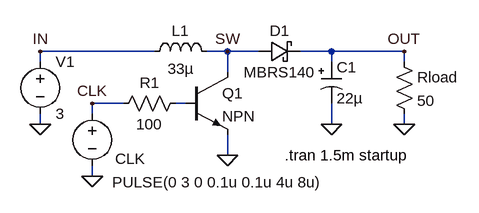
[diagram p0: schematic StepUp.asc]
StepUp.asc, the LTspice schematic file:
Version 4
SHEET 1 2376 1416
WIRE 1552 944 1376 944
WIRE 1664 944 1632 944
WIRE 1712 944 1664 944
WIRE 1824 944 1776 944
WIRE 1936 944 1824 944
WIRE 1376 960 1376 944
WIRE 1824 960 1824 944
WIRE 1936 960 1936 944
WIRE 1664 976 1664 944
WIRE 1504 1024 1456 1024
WIRE 1600 1024 1584 1024
WIRE 1456 1040 1456 1024
WIRE 1376 1056 1376 1040
WIRE 1824 1056 1824 1024
WIRE 1936 1056 1936 1040
WIRE 1664 1104 1664 1072
WIRE 1456 1136 1456 1120
FLAG 1936 944 OUT
FLAG 1824 1056 0
FLAG 1936 1056 0
FLAG 1376 1056 0
FLAG 1664 1104 0
FLAG 1376 944 IN
FLAG 1456 1136 0
FLAG 1456 1024 CLK
FLAG 1664 944 SW
SYMBOL VOLTAGE 1376 944 R0
WINDOW 123 0 0 Left 0
SYMATTR InstName V1
SYMATTR Value 3
SYMATTR SpiceLine Rser=0.1
SYMBOL POLCAP 1808 960 R0
SYMATTR InstName C1
SYMATTR Value 22µ
SYMATTR SpiceLine Rser=0.02
SYMBOL schottky 1712 960 R270
WINDOW 0 32 32 VTop 0
WINDOW 3 0 32 VBottom 0
SYMATTR InstName D1
SYMATTR Value MBRS140
SYMBOL IND 1536 960 R270
WINDOW 0 32 56 VTop 0
WINDOW 3 5 56 VBottom 0
SYMATTR InstName L1
SYMATTR Value 33µ
SYMATTR SpiceLine Rser=0.02 Rpar=5000
SYMBOL res 1920 944 R0
SYMATTR InstName Rload
SYMATTR Value 50
SYMBOL npn 1600 976 R0
SYMATTR InstName Q1
SYMBOL res 1600 1008 R90
WINDOW 0 0 56 VBottom 0
WINDOW 3 32 56 VTop 0
SYMATTR InstName R1
SYMATTR Value 100
SYMBOL voltage 1456 1024 R0
WINDOW 0 35 85 Left 0
WINDOW 3 31 121 Left 0
WINDOW 123 0 0 Left 0
WINDOW 39 0 0 Left 0
SYMATTR InstName CLK
SYMATTR Value PULSE(0 3 0 0.1u 0.1u 4u 8u)
TEXT 1752 1104 Left 0 !.tran 1.5m startup

The netlist it stands for:
* StepUp.asc
V1 IN 0 3 Rser=0.1
C1 OUT 0 22µ Rser=0.02
D1 SW OUT MBRS140
L1 IN SW 33µ Rser=0.02 Rpar=5000
Rload OUT 0 50
Q1 SW N001 0 0 NPN
R1 N001 CLK 100
V§CLK CLK 0 PULSE(0 3 0 0.1u 0.1u 4u 8u)
.model D D
.lib standard.dio
.model NPN NPN
.model PNP PNP
.lib standard.bjt
.tran 1.5m startup
.backanno
.end